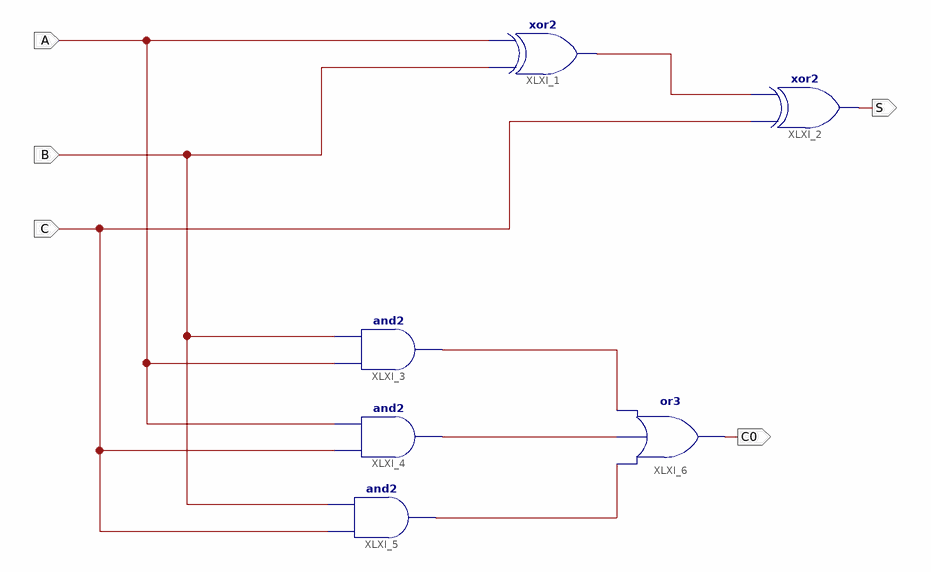
[diagram p0: schematic sheet 1]
// Xilinx ISE schematic Adder1b.sch (kintex7) as structural Verilog: 6 symbols, 5 ports
module Adder1b (
  input  A,
  input  C,
  input  B,
  output S,
  output C0
);

  wire XLXN_4, XLXN_15, XLXN_16, XLXN_18;

  xor XLXI_1 (XLXN_4, B, A);
  xor XLXI_2 (S, C, XLXN_4);
  and XLXI_3 (XLXN_15, A, B);
  and XLXI_4 (XLXN_16, C, A);
  and XLXI_5 (XLXN_18, C, B);
  or XLXI_6 (C0, XLXN_18, XLXN_16, XLXN_15);
endmodule
